# EAGLE design converter (EAGLE 6.5.0)
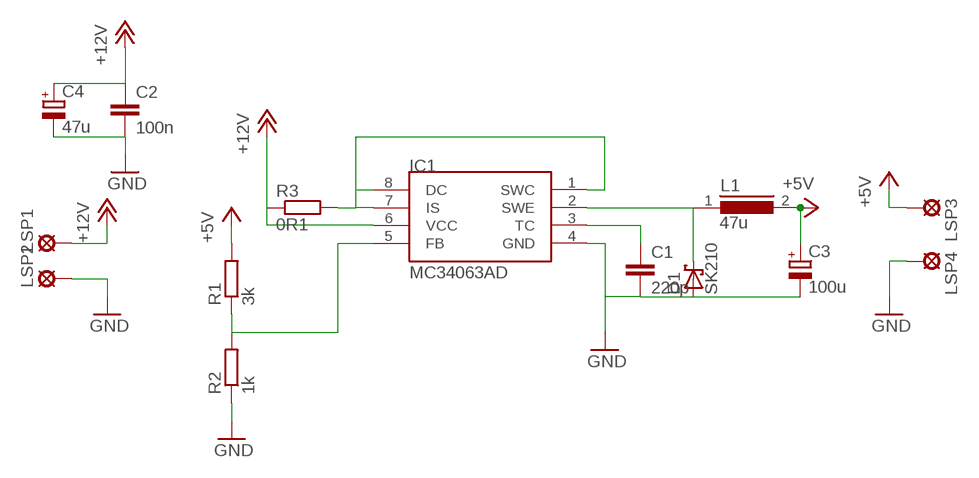
[diagram p0: schematic, sheet 1]

## Parts
C1  220p  C-EUC0805  [C0805]
C2  100n  C-EUC0805  [C0805]
C3  100u  CPOL-EUD  [PANASONIC_D]
C4  47u  CPOL-EUD  [PANASONIC_D]
D1  SK210  SCHOTTKY-DIODESMD  [SMB]
IC1  MC34063AD  [SOIC8]
L1  47u  DR127  [DR127]
LSP1  +12V  LSP11  [LSP11]
LSP2  GND  LSP11  [LSP11]
LSP3  LSP11  [LSP11]
LSP4  LSP11  [LSP11]
R1  3k  R-EU_R0805  [R0805]
R2  1k  R-EU_R0805  [R0805]
R3  0R1  R-EU_R0805  [R0805]

## Nets
+5V: C3.+ L1.2 LSP3.MP R1.2
+12V: C2.1 C4.+ IC1.6(VCC) LSP1.MP R3.1
GND: C1.2 C2.2 C3.- C4.- D1.A IC1.4(GND) LSP2.MP LSP4.MP R2.1
N$1: IC1.5(FB) R1.1 R2.2
N$2: IC1.1(SWC) IC1.7(IS) IC1.8(DC) R3.2
N$4: C1.1 IC1.3(TC)
N$6: D1.C IC1.2(SWE) L1.1

## Library data of the parts
C1 C2 = rcl:C-EU: CAPACITOR, European symbol
C3 C4 = rcl:CPOL-EU: POLARIZED CAPACITOR, European symbol
D1 = diode:SCHOTTKY-DIODE: Schottky Diode
IC1 = mc34063:MC34063
L1 = inductors:DR127: High Power Density, High Efficiency, Shielded Inductors Source: coiltronics_dr_series.pdf
LSP1-LSP4 = solpad:LSP11: SOLDER PAD drill 1.1 mm
R1-R3 = rcl:R-EU_: RESISTOR, European symbol

## Board
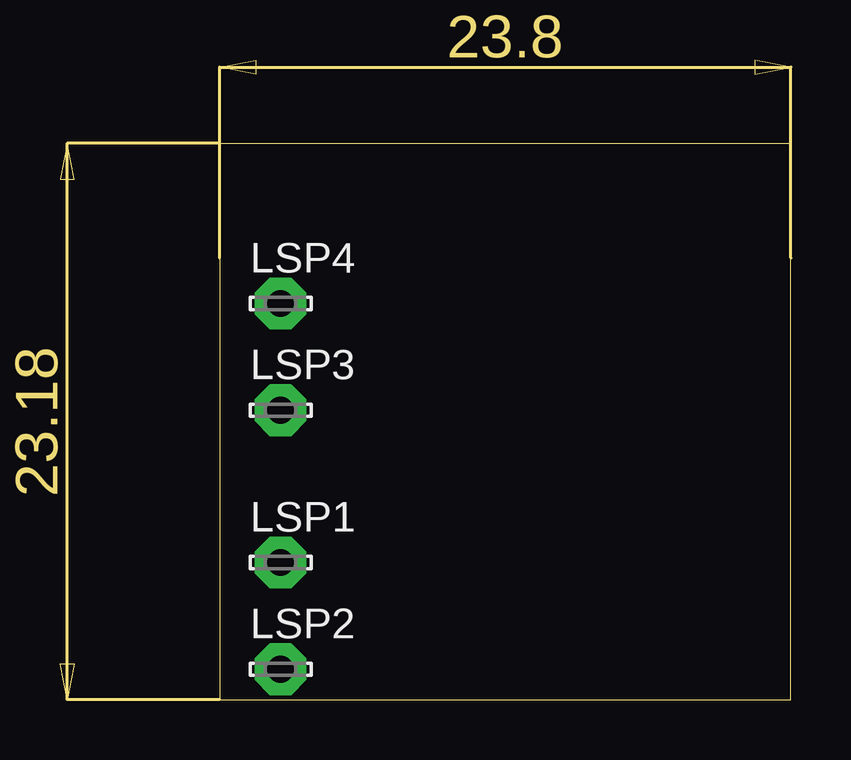
[diagram p1: board, top side]
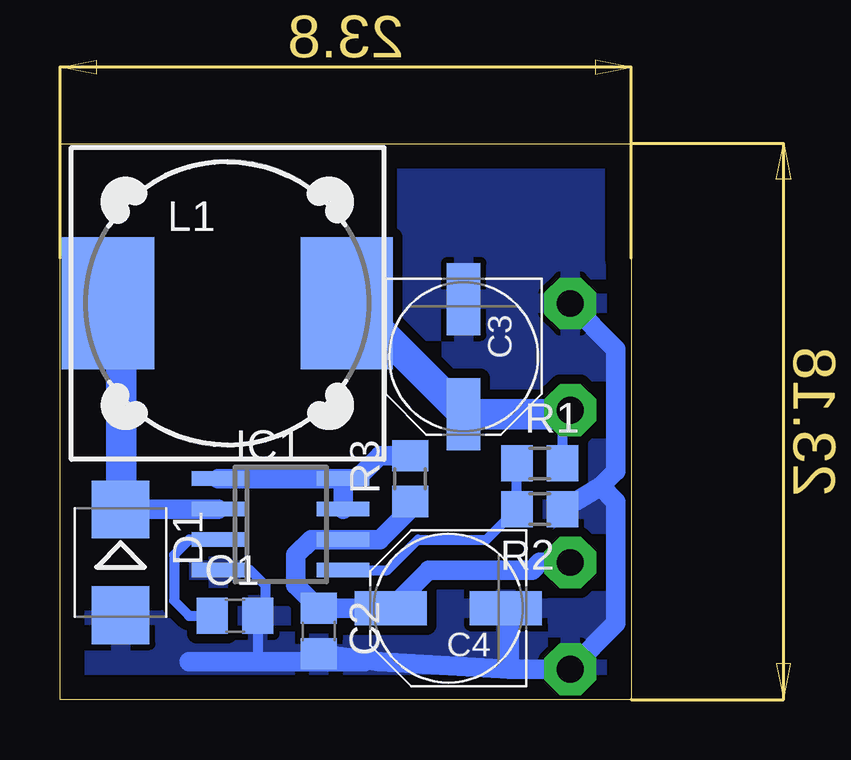
[diagram p2: board, bottom side, seen from below]

Size 23.8 x 23.17 mm. Coordinates in mm from the lower left corner, seen from the top.
Outline: 0,0 23.8,0 23.8,23.17 0,23.17 0,0
Copper layers (1*16): Top 0.035mm / dielectric 1.5mm / Bottom 0.035mm
Design rules "default": minimum track width 10mil, minimum drill 24mil, track to track 8mil, track to pad 8mil, pad to pad 8mil, via to via 8mil, smd to smd 8mil, copper to edge 40mil, drill to drill 8mil, minimum pad ring 10mil, minimum via ring 8mil, stop-mask expansion 4mil, vias tented up to drill 0mil, thermal gap 10mil
bRestrict: area 12.7,4.8 to 15.9,9.2; area 13.7,14 to 20.3,19; area 19.7,4.1 to 22.9,7; area 10.2,18.7 to 24.1,23.2

### Footprints (pad centres in the part's own frame; a part is rotated, then mirrored left to right if it is on the bottom)
C0805 = smd 1.3 x 1.5: 1 -0.95,0; 2 0.95,0
PANASONIC_D = smd 3 x 1.4: + 2.4,0; - -2.4,0
SMB = smd 2.4 x 2.4: A 2.2,0; C -2.2,0
SOIC8 = smd 0.6 x 2.2: 1 -1.905,-2.6; 2 -0.635,-2.6; 3 0.635,-2.6; 4 1.905,-2.6; 5 1.905,2.6; 6 0.635,2.6; 7 -0.635,2.6; 8 -1.905,2.6
DR127 = smd 3.85 x 5.5: 1 -4.975,0; 2 4.975,0
LSP11 = drill 1.118 pad 2.159 octagon: MP 0,0
R0805 = smd 1.3 x 1.5: 1 -0.95,0; 2 0.95,0

### Placement (x,y rotation side)
C1  16.51,3.49 0 bottom
C2  13.02,2.86 270 bottom
C3  6.98,14.29 270 bottom
C4  7.62,3.81 180 bottom
D1  21.27,5.71 270 bottom
IC1  14.61,7.3 270 bottom
L1  16.83,16.51 0 bottom
LSP1  2.54,5.71 0 top
LSP2  2.54,1.27 0 top
LSP3  2.54,12.06 0 top
LSP4  2.54,16.51 0 top
R1  3.81,9.84 0 bottom
R2  3.81,7.94 180 bottom
R3  9.21,9.21 90 bottom

### Tracks (layer width: path | path; a pad name or v marks a point on that pad's centre or on a via)
+5V
  Bottom 0.406: R1.2 2.86,11.74 LSP3.MP 2.72,11.89 | L1.2 11.61,16.51
  Bottom 1.27: 11.61,16.51 C3.+ 2.72,11.89
+12V
  Bottom 0.406: C2.1
  Bottom 0.813: C2.1 9.84,3.81 12.06,3.81 C4.+ 8.43,5.4 4.13,5.4 3.81,5.71 LSP1.MP | C2.1 13.97,4.76 13.97,6.03 13.33,6.67 IC1.6 10.48,6.67 9.21,7.94 R3.1
GND
  Bottom 0.406: IC1.4 15.87,5.4 15.24,4.76 15.24,3.81 C1.2 15.56,1.91 15.24,1.59 | C4.- 5.08,3.81
  Bottom 0.813: 5.08,1.27 LSP2.MP 0.63,3.18 0.63,8.25 1.27,8.89 | 5.08,1.27 10.47,1.59 C2.2 11.11,1.59 15.24,1.59 18.42,1.59 | 5.08,3.81 5.08,1.27 | 1.27,8.89 0.63,9.52 0.63,14.6 LSP4.MP | R2.1 1.27,8.89
  pour Bottom (isolate 0.406): 0,23.18 0,0 26.67,0 26.67,23.18
N$1
  Bottom 0.406: R1.1 R2.2 6.03,6.67 8.89,6.67 10.16,5.4 IC1.5
N$2
  Bottom 0.813: IC1.8 IC1.7 | IC1.8 IC1.1 | IC1.8 11.43,9.21 10.48,10.16 R3.2
N$4
  Bottom 0.406: IC1.3 18.42,6.67 19.05,6.03 19.05,4.13 18.42,3.49 C1.1
N$6
  Bottom 0.406: 21.25,7.94 D1.C | 21.25,15.96 L1.1
  Bottom 0.813: IC1.2 21.25,7.94
  Bottom 1.27: 21.25,7.94 21.25,15.96